# Altium project FRB_Simconex.PrjPcb
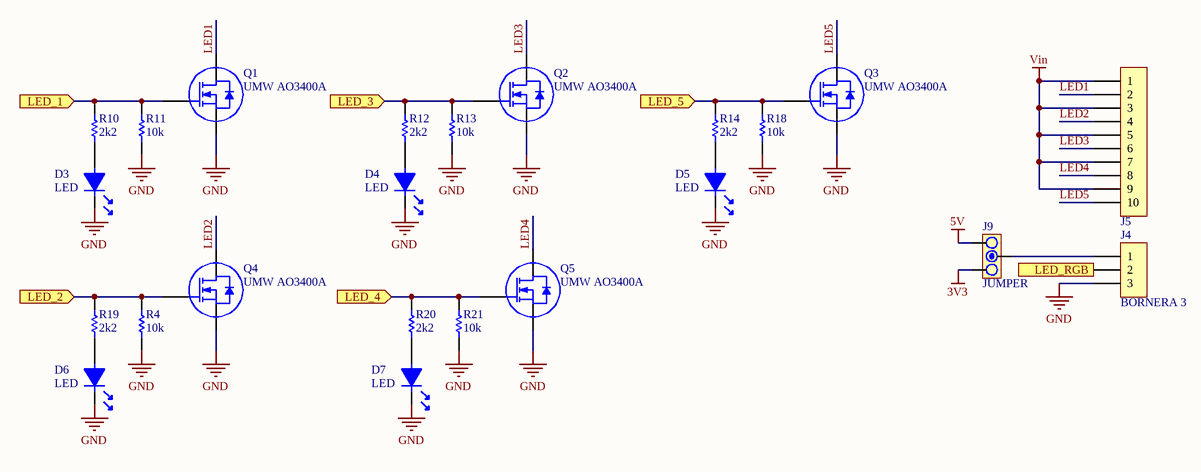
[diagram p0: Tiras LED.SchDoc]
3 sheets, 46 parts. Net scope: flat (ports and power ports of the same name join across sheets).
Board file: FRB_Simconex.PcbDoc
Sheets:
  Tiras LED.SchDoc
  Electrovalvulas.SchDoc
  Bomba Aire.SchDoc

## Sheet Tiras LED.SchDoc
size A4

### Parts
D3  LED  [LED0805]
D4  LED  [LED0805]
D5  LED  [LED0805]
D6  LED  [LED0805]
D7  LED  [LED0805]
J4  BORNERA 3  [BORNERA3]
J5  BORNERA10  [BORNERA10]  (value not drawn)
J9  JUMPER  [JUMPER3]
Q1  UMW AO3400A  [SOT23]
Q2  UMW AO3400A  [SOT23]
Q3  UMW AO3400A  [SOT23]
Q4  UMW AO3400A  [SOT23]
Q5  UMW AO3400A  [SOT23]
R4  10k  [0805]
R10  2k2  [0805]
R11  10k  [0805]
R12  2k2  [0805]
R13  10k  [0805]
R14  2k2  [0805]
R18  10k  [0805]
R19  2k2  [0805]
R20  2k2  [0805]
R21  10k  [0805]

### Ports
LED_1 (in), LED_2 (in), LED_3 (in), LED_4 (in), LED_5 (in), LED_RGB (in)

### Nets
3V3: J9.1
5V: J9.3
GND: D3.2 D4.2 D5.2 D6.2 D7.2 J4.3 Q1.3(S) Q2.3(S) Q3.3(S) Q4.3(S) Q5.3(S) R4.1 R11.1 R13.1 R18.1 R21.1
Vin: J5.1 J5.3 J5.5 J5.7 J5.9
LED1: J5.2 Q1.2(D)
LED2: J5.4 Q4.2(D)
LED3: J5.6 Q2.2(D)
LED4: J5.8 Q5.2(D)
LED5: J5.10 Q3.2(D)
NetD3_1: D3.1 R10.1
NetD4_1: D4.1 R12.1
NetD5_1: D5.1 R14.1
NetD6_1: D6.1 R19.1
NetD7_1: D7.1 R20.1
NetJ4_1: J4.1 J9.2
NetJ4_2: J4.2 ; port LED_RGB
NetQ1_1: Q1.1(G) R10.2 R11.2 ; port LED_1
NetQ2_1: Q2.1(G) R12.2 R13.2 ; port LED_3
NetQ3_1: Q3.1(G) R14.2 R18.2 ; port LED_5
NetQ4_1: Q4.1(G) R4.2 R19.2 ; port LED_2
NetQ5_1: Q5.1(G) R20.2 R21.2 ; port LED_4

### Library data of the parts
J9 = JUMPER3
Q1-Q5 = MOSFET N
R4 R10-R14 R18-R21 = RES

## Sheet Electrovalvulas.SchDoc
size A4
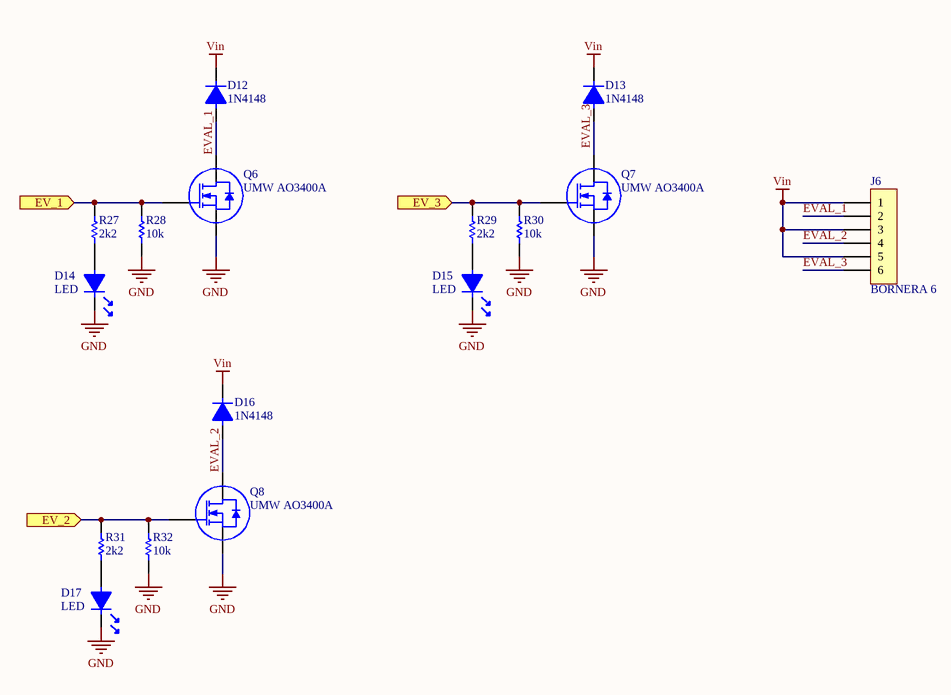
[diagram p1: Electrovalvulas.SchDoc]

### Parts
D12  1N4148  [1206K]
D13  1N4148  [1206K]
D14  LED  [LED0805]
D15  LED  [LED0805]
D16  1N4148  [1206K]
D17  LED  [LED0805]
J6  BORNERA 6  [BORNERA6]
Q6  UMW AO3400A  [SOT23]
Q7  UMW AO3400A  [SOT23]
Q8  UMW AO3400A  [SOT23]
R27  2k2  [0805]
R28  10k  [0805]
R29  2k2  [0805]
R30  10k  [0805]
R31  2k2  [0805]
R32  10k  [0805]

### Ports
EV_1 (in), EV_2 (in), EV_3 (in)

### Nets
GND: D14.2 D15.2 D17.2 Q6.3(S) Q7.3(S) Q8.3(S) R28.1 R30.1 R32.1
Vin: D12.2 D13.2 D16.2 J6.1 J6.3 J6.5
EVAL_1: D12.1 J6.2 Q6.2(D)
EVAL_2: D16.1 J6.4 Q8.2(D)
EVAL_3: D13.1 J6.6 Q7.2(D)
NetD14_1: D14.1 R27.1
NetD15_1: D15.1 R29.1
NetD17_1: D17.1 R31.1
NetQ6_1: Q6.1(G) R27.2 R28.2 ; port EV_1
NetQ7_1: Q7.1(G) R29.2 R30.2 ; port EV_3
NetQ8_1: Q8.1(G) R31.2 R32.2 ; port EV_2

### Library data of the parts
D12 D13 D16 = DIODO
Q6-Q8 = MOSFET N
R27-R32 = RES

## Sheet Bomba Aire.SchDoc
size A4
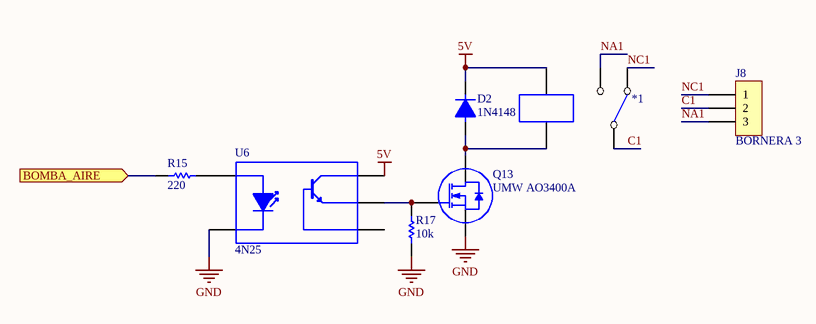
[diagram p2: Bomba Aire.SchDoc]

### Parts
*1  RELE SIMPLE  [RELE SERIE 964]  (value not drawn)
D2  1N4148  [1206K]
J8  BORNERA 3  [BORNERA3]
Q13  UMW AO3400A  [SOT23]
R15  220  [0805]
R17  10k  [0805]
U6  4N25  [SMD6]

### Ports
BOMBA_AIRE (in)

### Nets
5V: *1.B1 D2.2 U6.5(C)
GND: Q13.3(S) R17.1 U6.2(K)
C1: *1.C1 J8.2
NA1: *1.NA1 J8.3
NC1: *1.NC1 J8.1
Net*1_B2: *1.B2 D2.1 Q13.2(D)
NetQ13_1: Q13.1(G) R17.2 U6.4(E)
NetR15_1: R15.1 ; port BOMBA_AIRE
NetR15_2: R15.2 U6.1(A)

Not connected (* = marked no-connect by the designer): U6 6(B)

### Library data of the parts
D2 = DIODO
Q13 = MOSFET N
R15 R17 = RES

## Nets that join several sheets
5V: Tiras LED (J9.3), Bomba Aire (*1.B1 D2.2 U6.5)
GND: Tiras LED (16 pins), Electrovalvulas (9 pins), Bomba Aire (Q13.3 R17.1 U6.2)
Vin: Tiras LED (5 pins), Electrovalvulas (6 pins)